# EAGLE schematic v2 (EAGLE 9.3.2)
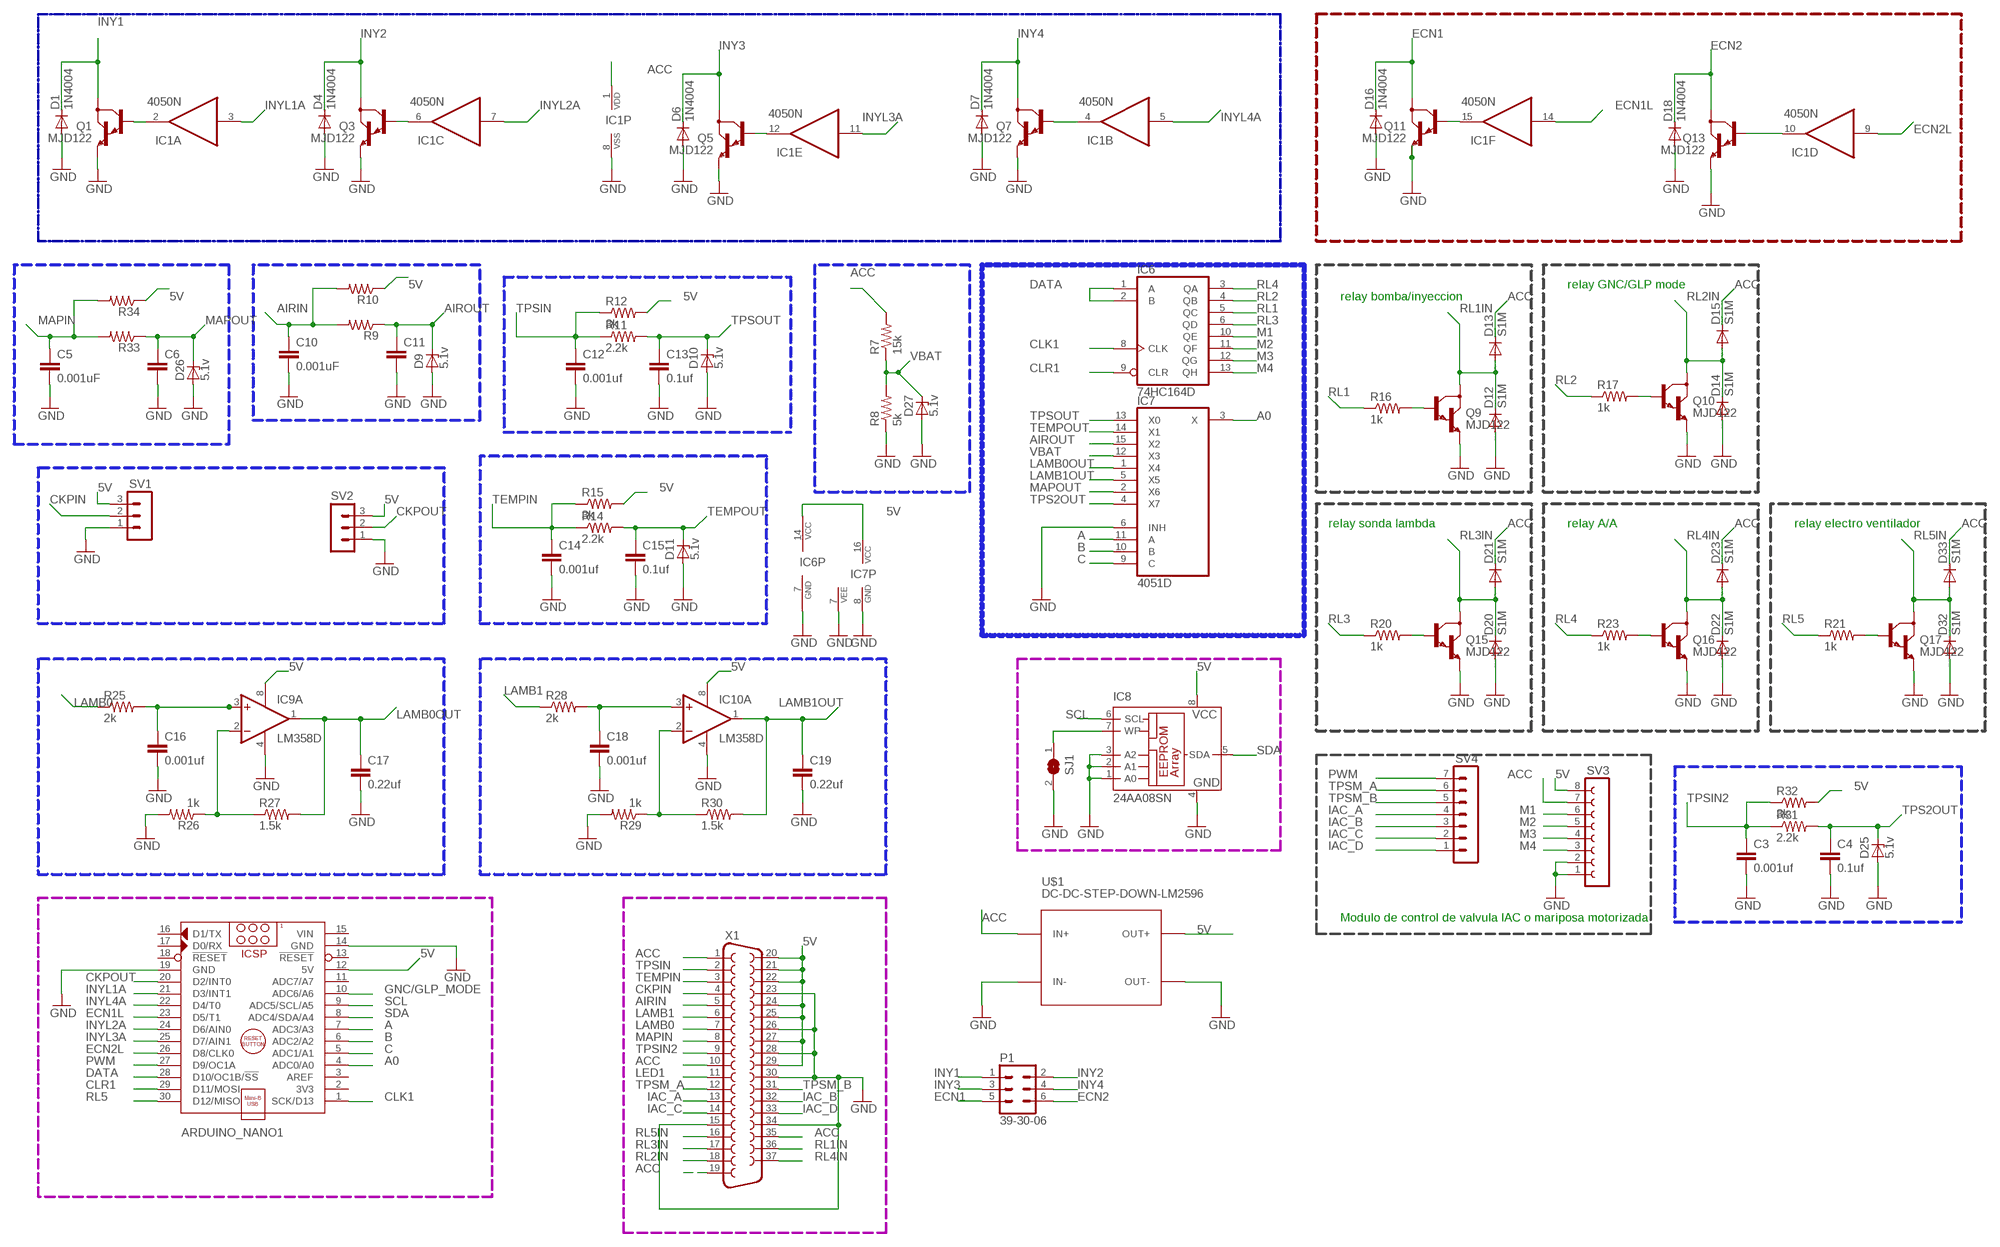
[diagram p0: schematic, sheet 1]

## Parts
ARDUINO_NANO1  ARDUINO_NANO  [ARDUINO_NANO]
C3  0.001uf  C-EU025-025X050  [C025-025X050]
C4  0.1uf  C-EU025-025X050  [C025-025X050]
C5  0.001uF  C-EU025-025X050  [C025-025X050]
C6  C-EU025-025X050  [C025-025X050]
C10  0.001uF  C-EU025-025X050  [C025-025X050]
C11  C-EU025-025X050  [C025-025X050]
C12  0.001uf  C-EU025-025X050  [C025-025X050]
C13  0.1uf  C-EU025-025X050  [C025-025X050]
C14  0.001uf  C-EU025-025X050  [C025-025X050]
C15  0.1uf  C-EU025-025X050  [C025-025X050]
C16  0.001uf  C-EU025-025X050  [C025-025X050]
C17  0.22uf  C-EU025-025X050  [C025-025X050]
C18  0.001uf  C-EU025-025X050  [C025-025X050]
C19  0.22uf  C-EU025-025X050  [C025-025X050]
D1  1N4004  [DO41-10]
D4  1N4004  [DO41-10]
D6  1N4004  [DO41-10]
D7  1N4004  [DO41-10]
D9  5.1v  ZENER-DIODEZD-5  [ZDIO-5]
D10  5.1v  ZENER-DIODEZD-5  [ZDIO-5]
D11  5.1v  ZENER-DIODEZD-5  [ZDIO-5]
D12  S1M  [SMA]
D13  S1M  [SMA]
D14  S1M  [SMA]
D15  S1M  [SMA]
D16  1N4004  [DO41-10]
D18  1N4004  [DO41-10]
D20  S1M  [SMA]
D21  S1M  [SMA]
D22  S1M  [SMA]
D23  S1M  [SMA]
D25  5.1v  ZENER-DIODEZD-5  [ZDIO-5]
D26  5.1v  ZENER-DIODEZD-5  [ZDIO-5]
D27  5.1v  ZENER-DIODEZD-5  [ZDIO-5]
D32  S1M  [SMA]
D33  S1M  [SMA]
IC1  4050N  [DIL16]
IC6  74HC164D  [SO14]
IC7  4051D  [SO16]
IC8  24AA08SN  [SO-08]
IC9  LM358D  [SO08]
IC10  LM358D  [SO08]
P1  39-30-06  [39-30-?06?]
Q1  MJD122  [DPAK]
Q3  MJD122  [DPAK]
Q5  MJD122  [DPAK]
Q7  MJD122  [DPAK]
Q9  MJD122  [DPAK]
Q10  MJD122  [DPAK]
Q11  MJD122  [DPAK]
Q13  MJD122  [DPAK]
Q15  MJD122  [DPAK]
Q16  MJD122  [DPAK]
Q17  MJD122  [DPAK]
R7  15k  R-US_0204/5  [0204/5]
R8  5k  R-US_0204/5  [0204/5]
R9  R-US_0204/5  [0204/5]
R10  R-US_0204/5  [0204/5]
R11  2.2k  R-US_0204/5  [0204/5]
R12  3k  R-US_0204/5  [0204/5]
R14  2.2k  R-US_0204/5  [0204/5]
R15  3k  R-US_0204/5  [0204/5]
R16  1k  R-US_0204/5  [0204/5]
R17  1k  R-US_0204/5  [0204/5]
R20  1k  R-US_0204/5  [0204/5]
R21  1k  R-US_0204/5  [0204/5]
R23  1k  R-US_0204/5  [0204/5]
R25  2k  R-US_0204/5  [0204/5]
R26  1k  R-US_0204/5  [0204/5]
R27  1.5k  R-US_0204/5  [0204/5]
R28  2k  R-US_0204/5  [0204/5]
R29  1k  R-US_0204/5  [0204/5]
R30  1.5k  R-US_0204/5  [0204/5]
R31  2.2k  R-US_0204/5  [0204/5]
R32  3k  R-US_0204/5  [0204/5]
R33  R-US_0204/5  [0204/5]
R34  R-US_0204/5  [0204/5]
SJ1  SJW  [SJW]
SV1  MA03-1  [MA03-1]
SV2  MA03-1  [MA03-1]
SV3  FE08-1  [FE08]
SV4  MA07-1  [MA07-1]
U$1  DC-DC-STEP-DOWN-LM2596  [DC-DC-STEP-DOWN-LM2596]
X1  F37HP  [F37HP]

## Nets
5V: ARDUINO_NANO1.12(5V) IC6.14(VCC) IC7.16(VCC) IC8.8(VCC) IC9.8(P:V+) IC10.8(P:V+) R10.1 R12.2 R15.2 R32.2 R34.1 SV1.3 SV2.3 SV3.8 U$1.OUT+ X1.20 X1.21 X1.22 X1.24 X1.25 X1.27 X1.29
A: ARDUINO_NANO1.7(ADC3/A3) IC7.11(A)
A0: ARDUINO_NANO1.4(ADC0/A0) IC7.3(X)
ACC: D13.C D15.C D21.C D23.C D33.C IC1.1(P:VDD) R7.2 SV3.7 U$1.IN+ X1.1 X1.10 X1.19 X1.35
AIRIN: C10.1 R9.2 R10.2 X1.5
AIROUT: C11.1 D9.C IC7.15(X2) R9.1
B: ARDUINO_NANO1.6(ADC2/A2) IC7.10(B)
C: ARDUINO_NANO1.5(ADC1/A1) IC7.9(C)
CKPIN: SV1.2 X1.4
CKPOUT: ARDUINO_NANO1.20(D2/INT0) SV2.2
CLK1: ARDUINO_NANO1.1(SCK/D13) IC6.8(CLK)
CLR1: ARDUINO_NANO1.29(D11/MOSI) IC6.9(CLR)
DATA: ARDUINO_NANO1.28(D10/OC1B/!SS) IC6.1(A) IC6.2(B)
ECN1: D16.C P1.5 Q11.4(C)
ECN1L: ARDUINO_NANO1.23(D5/T1) IC1.14(F:I)
ECN2: D18.C P1.6 Q13.4(C)
ECN2L: ARDUINO_NANO1.26(D8/CLK0) IC1.9(D:I)
GNC/GLP_MODE: ARDUINO_NANO1.10(ADC6/A6)
GND: ARDUINO_NANO1.14(GND) ARDUINO_NANO1.19(GND) C3.2 C4.2 C5.2 C6.2 C10.2 C11.2 C12.2 C13.2 C14.2 C15.2 C16.2 C17.2 C18.2 C19.2 D1.A D4.A D6.A D7.A D9.A D10.A D11.A D12.A D14.A D16.A D18.A D20.A D22.A D25.A D26.A D27.A D32.A IC1.8(P:VSS) IC6.7(GND) IC7.6(INH) IC7.7(VEE) IC7.8(GND) IC8.1(A0) IC8.2(A1) IC8.3(A2) IC8.4(GND) IC9.4(P:V-) IC10.4(P:V-) Q1.3(E) Q3.3(E) Q5.3(E) Q7.3(E) Q9.3(E) Q10.3(E) Q11.3(E) Q13.3(E) Q15.3(E) Q16.3(E) Q17.3(E) R8.1 R26.2 R29.2 SJ1.2 SV1.1 SV2.1 SV3.1 SV3.2 U$1.IN- U$1.OUT- X1.15 X1.23 X1.26 X1.28 X1.30 X1.34
IAC_A: SV4.4 X1.13
IAC_B: SV4.3 X1.32
IAC_C: SV4.2 X1.14
IAC_D: SV4.1 X1.33
INY1: D1.C P1.1 Q1.4(C)
INY2: D4.C P1.2 Q3.4(C)
INY3: D6.C P1.3 Q5.4(C)
INY4: D7.C P1.4 Q7.4(C)
INYL1A: ARDUINO_NANO1.21(D3/INT1) IC1.3(A:I)
INYL2A: ARDUINO_NANO1.24(D6/AIN0) IC1.7(C:I)
INYL3A: ARDUINO_NANO1.25(D7/AIN1) IC1.11(E:I)
INYL4A: ARDUINO_NANO1.22(D4/T0) IC1.5(B:I)
LAMB0: R25.1 X1.7
LAMB0OUT: C17.1 IC7.1(X4) IC9.1(A:OUT) R27.2
LAMB1: R28.1 X1.6
LAMB1OUT: C19.1 IC7.5(X5) IC10.1(A:OUT) R30.2
LED1: X1.11
M1: IC6.10(QE) SV3.6
M2: IC6.11(QF) SV3.5
M3: IC6.12(QG) SV3.4
M4: IC6.13(QH) SV3.3
MAPIN: C5.1 R33.2 R34.2 X1.8
MAPOUT: C6.1 D26.C IC7.2(X6) R33.1
N$1: C18.1 IC10.3(A:+IN) R28.2
N$2: IC1.2(A:O) Q1.1(B)
N$3: IC1.6(C:O) Q3.1(B)
N$4: Q9.1(B) R16.2
N$5: IC1.12(E:O) Q5.1(B)
N$6: IC1.4(B:O) Q7.1(B)
N$7: Q17.1(B) R21.2
N$8: Q10.1(B) R17.2
N$9: IC1.15(F:O) Q11.1(B)
N$10: IC1.10(D:O) Q13.1(B)
N$19: Q15.1(B) R20.2
N$29: Q16.1(B) R23.2
N$31: C16.1 IC9.3(A:+IN) R25.2
N$32: IC9.2(A:-IN) R26.1 R27.1
N$34: IC8.7(WP) SJ1.1
N$37: IC10.2(A:-IN) R29.1 R30.1
PWM: ARDUINO_NANO1.27(D9/OC1A) SV4.7
RL1: IC6.5(QC) R16.1
RL1IN: D12.C D13.A Q9.4(C) X1.36
RL2: IC6.4(QB) R17.1
RL2IN: D14.C D15.A Q10.4(C) X1.18
RL3: IC6.6(QD) R20.1
RL3IN: D20.C D21.A Q15.4(C) X1.17
RL4: IC6.3(QA) R23.1
RL4IN: D22.C D23.A Q16.4(C) X1.37
RL5: ARDUINO_NANO1.30(D12/MISO) R21.1
RL5IN: D32.C D33.A Q17.4(C) X1.16
SCL: ARDUINO_NANO1.9(ADC5/SCL/A5) IC8.6(SCL)
SDA: ARDUINO_NANO1.8(ADC4/SDA/A4) IC8.5(SDA)
TEMPIN: C14.1 R14.1 R15.1 X1.3
TEMPOUT: C15.1 D11.C IC7.14(X1) R14.2
TPS2OUT: C4.1 D25.C IC7.4(X7) R31.2
TPSIN: C12.1 R11.1 R12.1 X1.2
TPSIN2: C3.1 R31.1 R32.1 X1.9
TPSM_A: SV4.6 X1.12
TPSM_B: SV4.5 X1.31
TPSOUT: C13.1 D10.C IC7.13(X0) R11.2
VBAT: D27.C IC7.12(X3) R7.1 R8.2
Unconnected: ARDUINO_NANO1.2(3V3) ARDUINO_NANO1.3(AREF) ARDUINO_NANO1.11(ADC7/A7) ARDUINO_NANO1.13(!RESET) ARDUINO_NANO1.16(D1/TX) ARDUINO_NANO1.17(D0/RX) ARDUINO_NANO1.18(!RESET) IC9.5(B:+IN) IC9.6(B:-IN) IC9.7(B:OUT) IC10.5(B:+IN) IC10.6(B:-IN) IC10.7(B:OUT)

## Buses
B$1

## Notes on the sheet
- relay GNC/GLP mode
- relay bomba/inyeccion
- relay sonda lambda | relay A/A | relay electro ventilador
- Modulo de control de valvula IAC o mariposa motorizada

## Power pins joined to a net without a drawn wire
VIN: ARDUINO_NANO1.15(VIN)

## Library data of the parts
ARDUINO_NANO1 = ArduinoNanoV30:ARDUINO_NANO: Arduino Nano V3.0 Module Overview: The Arduino Nano is a small, complete, and breadboard-friendly board based on the ATmega328 (Arduino Nano 3.x) or ATmega168 (Arduino Nano 2.x). It has more or less the same functionality of the Arduino Duemilanove, but in a different package. It lacks only a DC power jack, and works with a Mini-B USB cable instead of a standard one. The Nano was designed and is being produced by Gravitech <http://www.gravitech.us/arna30wiatp.html>. General specifications: Item Value Microcontroller Atmel ATmega168 or ATmega328 Operating Voltage (logic level) 5 V Input Voltage (recommended) 7-12 V Input Voltage (limits) 6-20 V Digital I/O Pins 14 (of which 6 provide PWM output) Analog Input Pins 8 DC Current per I/O Pin 40 mA Flash Memory 16 KB (ATmega168) or 32 KB (ATmega328) of which 2 KB used by bootloader SRAM 1 KB (ATmega168) or 2 KB (ATmega328) EEPROM 512 bytes (ATmega168) or 1 KB (ATmega328) Clock Speed 16 MHz Dimensions (Inches) 0.73" x 1.70" Dimensions (mm) 18mm x 45mm Overall height About 9 mm (not including pins) Weigth 5 g Power: The Arduino Nano can be powered via the Mini-B USB connection, 6-20V unregulated external power supply (pin 30), or 5V regulated external power supply (pin 27). The power source is automatically selected to the highest voltage source. Memory: The ATmega168 has 16 KB of flash memory for storing code (of which 2 KB is used for the bootloader); the ATmega328 has 32 KB, (also with 2 KB used for the bootloader). The ATmega168 has 1 KB of SRAM and 512 bytes of EEPROM (which can be read and written with the EEPROM library); the ATmega328 has 2 KB of SRAM and 1 KB of EEPROM. Input and Output: Each of the 14 digital pins on the Nano can be used as an input or output, using pinMode(), digitalWrite(), and digitalRead() functions. They operate at 5 volts. Each pin can provide or receive a maximum of 40 mA and has an internal pull-up resistor (disconnected by default) of 20-50 kOhms. In addition, some pins have specialized functions. Visit Arduino - ArduinoBoardNano <https://www.arduino.cc/en/Main/ArduinoBoardNano>
C3-C6 C10-C19 = rcl:C-EU: CAPACITOR, European symbol; SPICEPREFIX: C
D1 D4 D6 D7 D16 D18 = diode:1N4004: DIODE general purpose rectifier, 1 A
D9-D11 D25-D27 = diode:ZENER-DIODE: Z-Diode
D12-D15 D20-D23 D32 D33 = diode:S1M
IC1 = 40xx:4050: Hex non-inverting BUFFER
IC6 = 74xx-us:74*164: 8-bit parallel out SHIFT REGISTER
IC7 = 40xx:4051: 8-channel ANALOG MULTIPLEXER
IC8 = microchip:24*: Serial EEPROM I2C; MF: MICROCHIP; MPN: 24AA08-I/SN; OC_FARNELL: 1579568; OC_NEWARK: 92C6826
IC9 IC10 = linear:LM358: OP AMP also LM158; LM258; LM2904 Source: http://cache.national.com/ds/LM/LM158.pdf
P1 = con-molex-mini-fit:39-30-?06?: HEADER
Q1 Q3 Q5 Q7 Q9-Q11 Q13 Q15-Q17 = MJD122:MJD122: TRANS DARL NPN 100V 5A DPAK; AVAILABILITY: Unavailable; MF: STMicroelectronics; MP: MJD122; PACKAGE: None; PRICE: None
R7-R12 R14-R17 R20 R21 R23 R25-R34 = rcl:R-US_: RESISTOR, American symbol; SPICEPREFIX: R
SJ1 = jumper:SJ: SMD solder JUMPER
SV1 SV2 = con-lstb:MA03-1: PIN HEADER; OC_FARNELL: unknown; OC_NEWARK: unknown
SV3 = con-lsta:FE08-1: FEMALE HEADER; OC_FARNELL: unknown; OC_NEWARK: unknown
SV4 = con-lstb:MA07-1: PIN HEADER; OC_FARNELL: unknown; OC_NEWARK: unknown
U$1 = diy-modules:DC-DC-STEP-DOWN-LM2596: DC/DC Step-Down Regulator based on LM2596-ADJ chip LM2596 datasheet available here: http://www.ti.com/lit/ds/symlink/lm2596.pdf Click here to find device on ebay.com <http://www.ebay.com/sch/lm2596+power+regulator>
X1 = con-subd:F37: SUB-D; OC_FARNELL: unknown; OC_NEWARK: unknown